# EasyEDA Pro project GEOF_MainBoard.eprj

# Schematic Schematic1
Board Name: Board1; Create Date: 2025-01-05; Page Name: P1; Project Name: GEOF_MainBoard; Schematic Name: Schematic1; Update Date: 2025-01-18; Company: EasyEDA.com; Page Size: A4; Version: 1.1
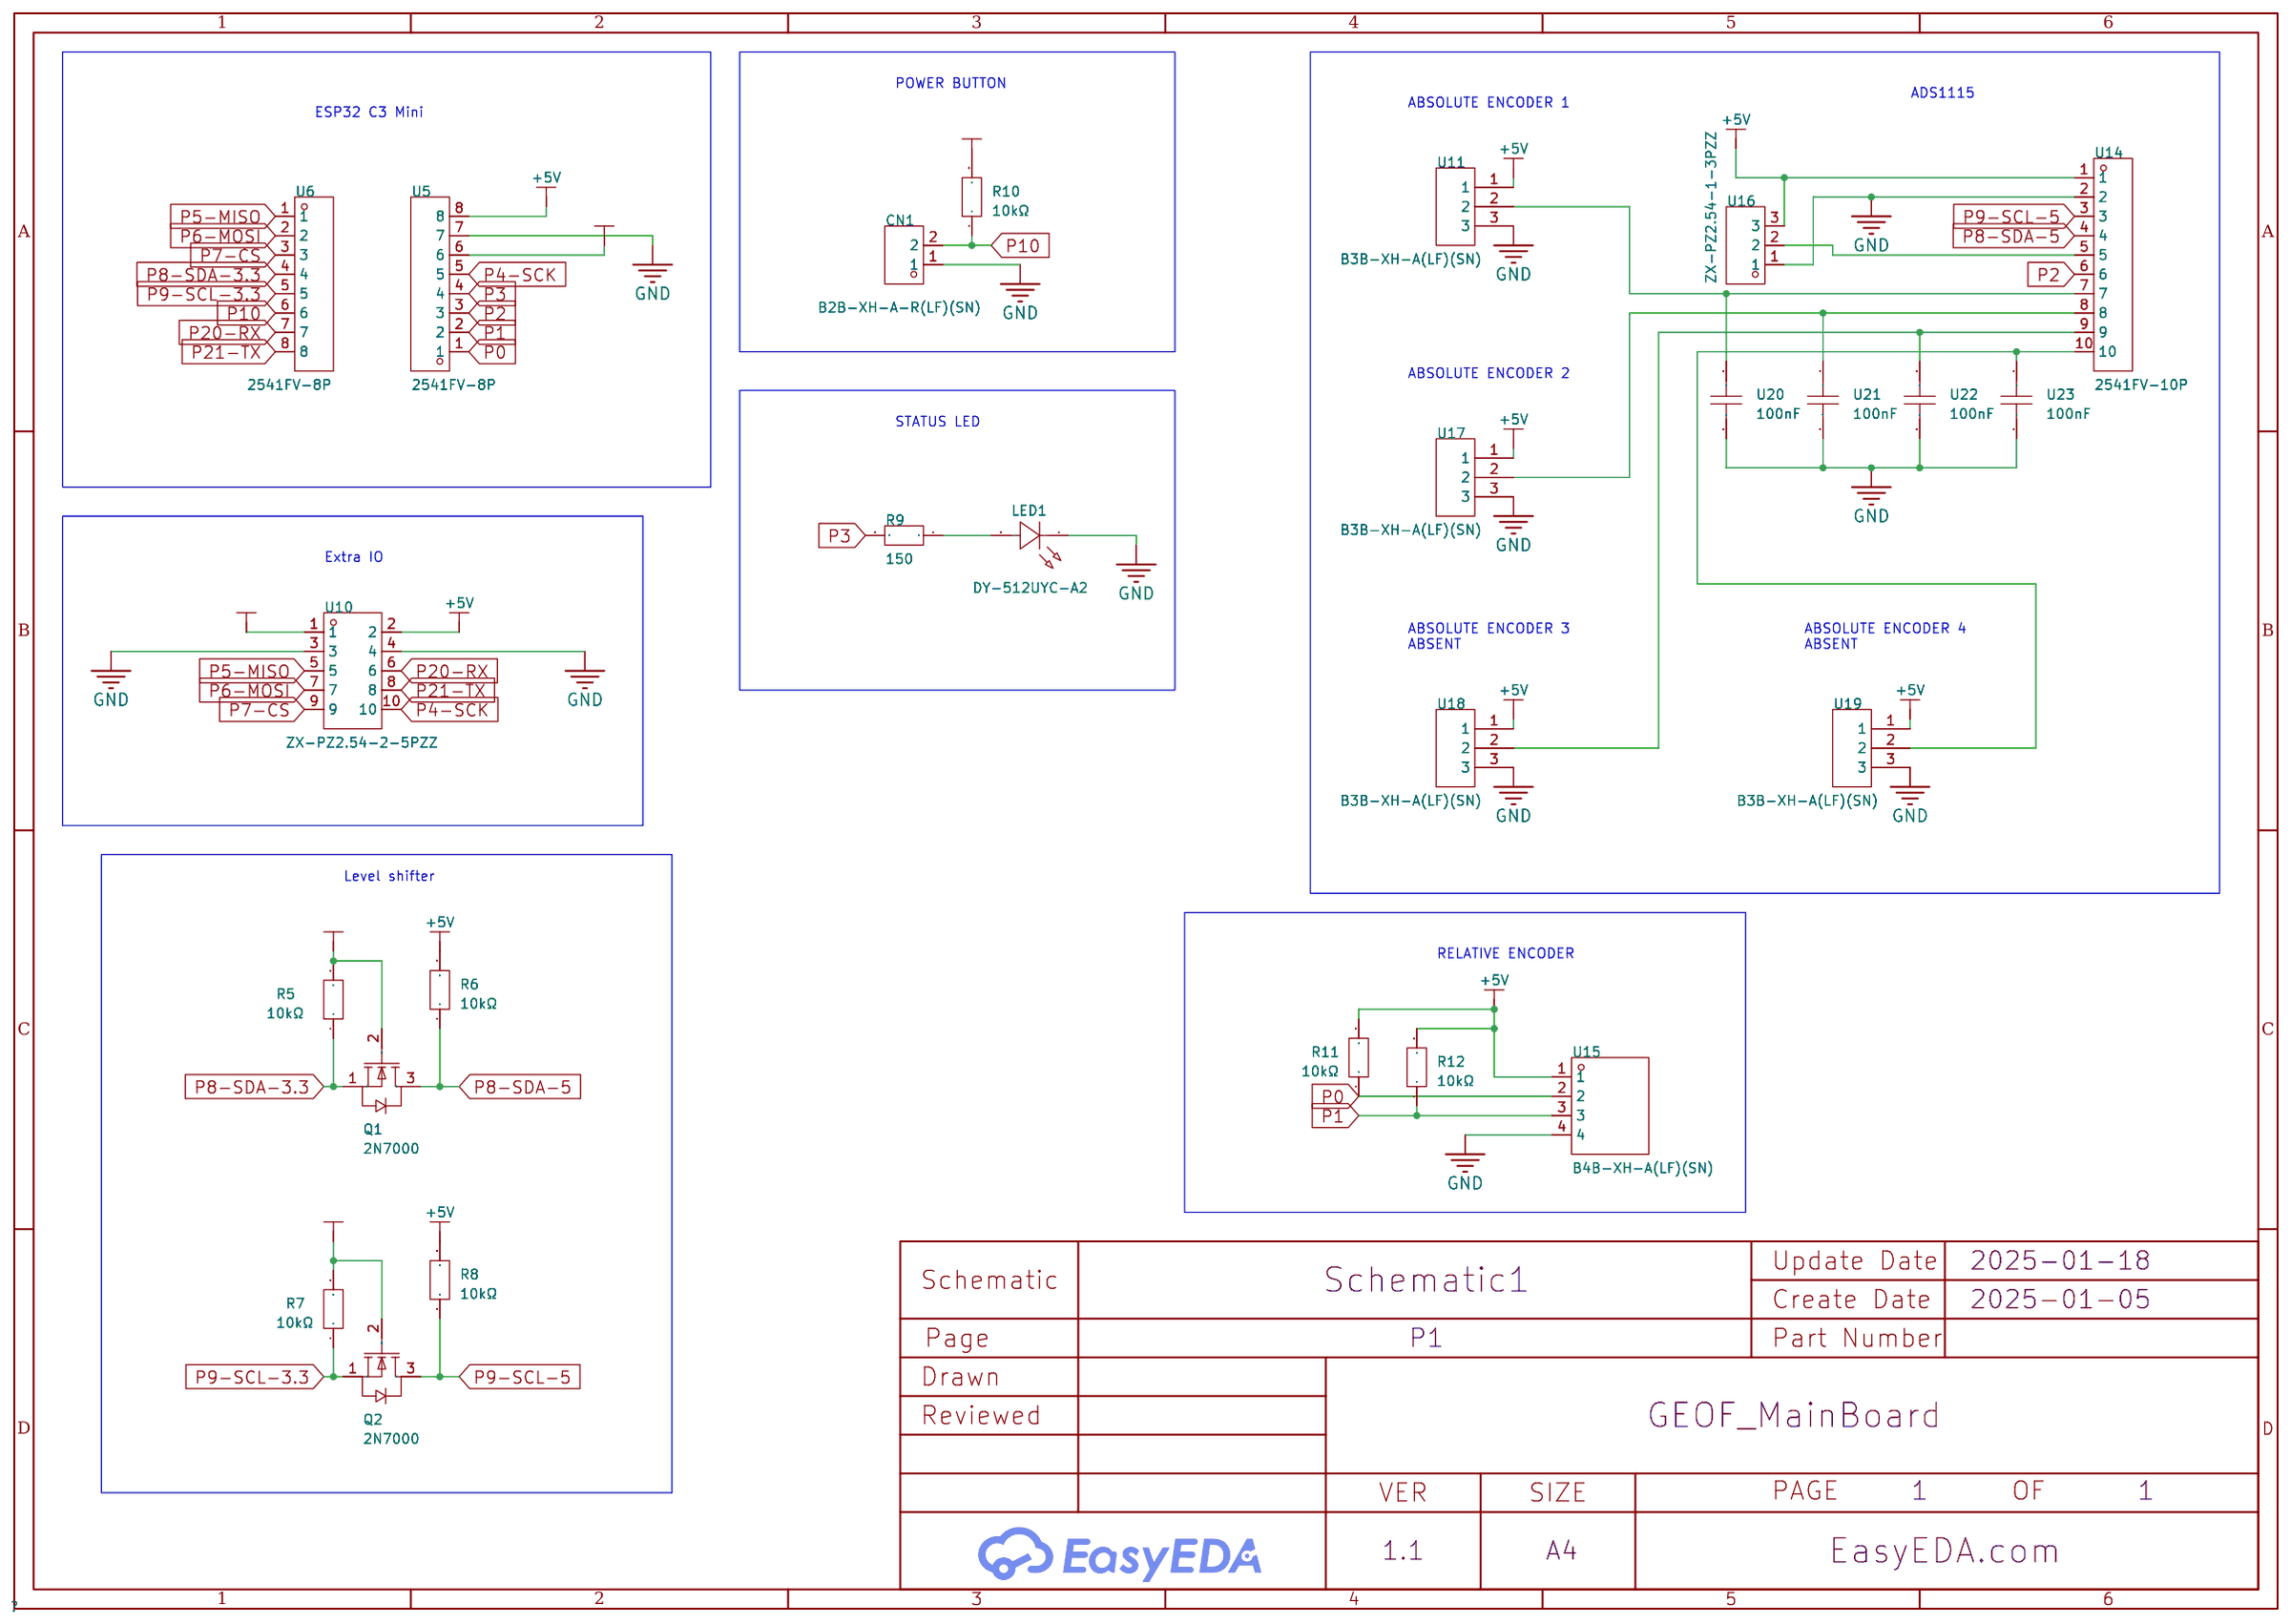
[diagram p0: schematic sheet]

## Parts
CN1  B2B-XH-A-R(LF)(SN)  [CONN-TH_B2B-XH-A]
LED1  DY-512UYC-A2  [LED-TH_L3.2-W2.0-P2.54-RD]
Q1  2N7000  [TO-92-3_L4.9-W3.7-P1.27-L]
Q2  2N7000  [TO-92-3_L4.9-W3.7-P1.27-L]
R5  10kΩ  [RES-TH_BD2.7-L6.2-P10.20-D0.4]
R6  10kΩ  [RES-TH_BD2.7-L6.2-P10.20-D0.4]
R7  10kΩ  [RES-TH_BD2.7-L6.2-P10.20-D0.4]
R8  10kΩ  [RES-TH_BD2.7-L6.2-P10.20-D0.4]
R9  150  [RES-TH_BD2.7-L6.2-P10.20-D0.4]
R10  10kΩ  [RES-TH_BD2.7-L6.2-P10.20-D0.4]
R11  10kΩ  [RES-TH_BD2.7-L6.2-P10.20-D0.4]
R12  10kΩ  [RES-TH_BD2.7-L6.2-P10.20-D0.4]
U5  2541FV-8P  [HDR-TH_8P-P2.54-V-F]
U6  2541FV-8P  [HDR-TH_8P-P2.54-V-F]
U10  ZX-PZ2.54-2-5PZZ  [HDR-TH_10P-P2.54-V-M-R2-C5-S2.54]
U11  B3B-XH-A(LF)(SN)  [CONN-TH_3P-P2.50_A2501WV2-3P]
U14  2541FV-10P  [HDR-TH_10P-P2.54-V-F]
U15  B4B-XH-A(LF)(SN)  [CONN-TH_B4B-XH-A-LF-SN]
U16  ZX-PZ2.54-1-3PZZ  [HDR-TH_3P-P2.54-V-M-1]
U17  B3B-XH-A(LF)(SN)  [CONN-TH_3P-P2.50_A2501WV2-3P]
U18  B3B-XH-A(LF)(SN)  [CONN-TH_3P-P2.50_A2501WV2-3P]
U19  B3B-XH-A(LF)(SN)  [CONN-TH_3P-P2.50_A2501WV2-3P]
U20  100nF  [CAP-TH_L4.8-W2.4-P5.08-D0.6]
U21  100nF  [CAP-TH_L4.8-W2.4-P5.08-D0.6]
U22  100nF  [CAP-TH_L4.8-W2.4-P5.08-D0.6]
U23  100nF  [CAP-TH_L4.8-W2.4-P5.08-D0.6]

## Library data of the parts
CN1 = B2B-XH-A-R(LF)(SN): Pins Structure:1x2P Pitch:2.5mm Mounting Style:Direct Insert Reference Series:XH Number of Pins:2P Number of Rows:1 Number of PINs Per Row:2 Row Spacing:- Current Rating (Max):3A Contact Material:Brass Contact Plating:Tin Operating Temperature Range:-25℃~; LCSC Part Name: 1x2P 间距:2.5mm 直插 系列:XH; Supplier Part: C495685; Manufacturer: JST; Supplier Footprint: 插件,P=2.5mm; JLCPCB Part Class: Extended Part; Datasheet: https://atta.szlcsc.com/upload/public/pdf/source/20200407/C495685_79B155586C4C18317C5B8095BAFA39F5.pdf; Supplier: LCSC; Pins Structure: 1x2P; Pitch: 2.5mm; Mounting Style: Direct Insert; Reference Series: XH; Number of Pins: 2P; Number of Rows: 1; Number of PINs Per Row: 2; Current Rating (Max): 3A; Contact Material: Brass; Contact Plating: Tin; Operating Temperature Range: -25℃~+85℃; Rated Voltage (Max): 250V; Plastic Material: PA66; Flame Retardant Rating: UL94V-0; Supplementary Features: K-leg punch; Colour: Red; Z-Height of the Board: 7mm; X-Length of Bottom Edge on Board (Spacing Line): 7.4mm; Y-Width of Bottom Edge on Board: 5.75mm
LED1 = DY-512UYC-A2: LCSC Part Name: 黄灯; Supplier Part: C841519; Manufacturer: TONYU(东裕); Supplier Footprint: 插件,D=3.2mm; JLCPCB Part Class: Extended Part; Datasheet: https://atta.szlcsc.com/upload/public/pdf/source/20200922/C841519_B7E0EF698131DB490D3B1EBAF39E2160.pdf; Supplier: LCSC; Lamp Holder Type: 3.2mm Square Lamp Head; Emitted Color: Yellow; Forward Voltage (VF): 1.8V~2.4V; Power Dissipation: 60mW; Forward Current: 20mA; Dominant Wavelength: 588nm~595nm; Peak Wavelength: 593nm; Lens Color: Colorless transparent lens; Luminous Intensity: 63mcd~125mcd; Viewing Angle: 100°; Operating Temperature: -25℃~+80℃
Q1 Q2 = 2N7000: LCSC Part Name: 1个N沟道 耐压:60V 电流:200mA; Supplier Part: C232838; Manufacturer: onsemi(安森美); Supplier Footprint: TO-92-3; JLCPCB Part Class: Extended Part; Datasheet: https://atta.szlcsc.com/upload/public/pdf/source/20221020/6B07E43F0B4B9B39AB447A9A1885F5BD.pdf; Supplier: LCSC; Type: 1 N-Channel; Drain Source On Resistance (RDS(on)@Vgs,Id): 5Ω@10V,500mA; Gate Threshold Voltage (Vgs(th)@Id): 3V@1mA
R5-R12 = MF1/4W-10K±1%-ST52: LCSC Part Name: 金属膜电阻 10kΩ ±1% 250mW; Supplier Part: C2903232; Manufacturer: VO(翔胜); Supplier Footprint: 插件,D2.7xL6.2mm; JLCPCB Part Class: Extended Part; Datasheet: https://atta.szlcsc.com/upload/public/pdf/source/20200609/C601728_5AA4C0C8E12E11069DA2C3356F29D1F2.pdf; Supplier: LCSC; Type: Metal Film Resistors; Tolerance: ±1%; Overload Voltage (Max): 250V; Power(Watts): 250mW; Temperature Coefficient: ±100ppm/℃; Operating Temperature Range: -55℃~+155℃
U5 U6 = 2541FV-8P: Holes Structure:1x8P Pitch:2.54mm Circular Hole / Square Hole:Square Hole Mounting Type:Direct Insert Number of Rows:Single Row Number of Holes:8P Current Rating (Max):3A Voltage Rating (Max):250V Holes Direction:Top Operating Temperature Range:-40℃~+105℃; LCSC Part Name: 间距:2.54mm 1x8P 直插; Supplier Part: C18723052; Manufacturer: HanElectricity(瀚源); Supplier Footprint: 插件,P=2.54mm; JLCPCB Part Class: Extended Part; Datasheet: https://atta.szlcsc.com/upload/public/pdf/source/20231018/B668E998F75351C6E5E9C8B59ACADD5C.pdf; Supplier: LCSC; Holes Structure: 1x8P; Pitch: 2.54mm; Circular Hole / Square Hole: Square Hole; Mounting Type: Direct Insert; Number of Rows: Single Row; Number of Holes: 8P; Current Rating (Max): 3A; Voltage Rating (Max): 250V; Holes Direction: Top; Operating Temperature Range: -40℃~+105℃
U10 = ZX-PZ2.54-2-5PZZ: Pin Structure:2x5P Pitch:2.54mm Row Spacing:2.54mm Circluar Pins/Square Pins:Square Pins Mounting Type:Straight Number of Rows:双排 Number of Pins:10P Current Rating (Max):3A Voltage Rating (Max):1kV Length of Mating Pin:6mm Insulation Height:2.5mm Length o; LCSC Part Name: 2x5P 间距:2.54mm 方针 直插; Supplier Part: C7501276; Manufacturer: Megastar(兆星); Supplier Footprint: 插件,P=2.54mm; JLCPCB Part Class: Extended Part; Datasheet: https://atta.szlcsc.com/upload/public/pdf/source/20231122/7DD2FA5A7FDBC10CDDB6051CB6BC6AD1.pdf; Supplier: LCSC; Pin Structure: 2x5P; Pitch: 2.54mm; Row Spacing: 2.54mm; Circluar Pins/Square Pins: Square Pins; Mounting Type: Straight; Number of Rows: 双排; Number of Pins: 10P; Current Rating (Max): 3A; Voltage Rating (Max): 1kV; Length of Mating Pin: 6mm; Insulation Height: 2.5mm; Length of End Connection Pin: 3mm; Contact Plating: Gold; Operating Temperature Range: -40℃~+105℃; Color: Black
U11 U17-U19 = B3B-XH-A(LF)(SN): Pins Structure:1x3P Pitch:2.5mm Mounting Style:Direct Insert Reference Series:XH Number of Pins:3P Number of Rows:1 Number of PINs Per Row:3 Row Spacing:- Current Rating (Max):3A Contact Material:Brass Contact Plating:Tin Operating Temperature Range:-25℃~; LCSC Part Name: 1x3P 间距:2.5mm 直插 系列:XH; Supplier Part: C144394; Manufacturer: JST; Supplier Footprint: 插件,P=2.5mm; JLCPCB Part Class: Extended Part; Datasheet: https://atta.szlcsc.com/upload/public/pdf/source/20180928/C265283_F9DFEEBDB2CF642B6BDFAB4B77BD2680.pdf; Supplier: LCSC; Pins Structure: 1x3P; Pitch: 2.5mm; Mounting Style: Direct Insert; Reference Series: XH; Number of Pins: 3P; Number of Rows: 1; Number of PINs Per Row: 3; Current Rating (Max): 3A; Contact Material: Brass; Contact Plating: Tin; Operating Temperature Range: -25℃~+85℃; Rated Voltage (Max): 250V; Plastic Material: PA66; Flame Retardant Rating: UL94V-0; Supplementary Features: K-leg punch; Colour: White; Z-Height of the Board: 7mm; X-Length of Bottom Edge on Board (Spacing Line): 9.9mm; Y-Width of Bottom Edge on Board: 5.75mm
U14 = 2541FV-10P: LCSC Part Name: 间距:2.54mm 1x10P 直插; Supplier Part: C18722933; Manufacturer: HanElectricity(瀚源); Supplier Footprint: 插件,P=2.54mm; JLCPCB Part Class: Extended Part; Datasheet: https://atta.szlcsc.com/upload/public/pdf/source/20231018/B668E998F75351C6E5E9C8B59ACADD5C.pdf; Supplier: LCSC; Holes Structure: 1x10P; Pitch: 2.54mm; Circular Hole / Square Hole: Square Hole; Mounting Type: Direct Insert; Number of Rows: Single Row; Number of Holes: 10P; Current Rating (Max): 3A; Voltage Rating (Max): 250V; Holes Direction: Top; Operating Temperature Range: -40℃~+105℃
U15 = B4B-XH-A(LF)(SN): LCSC Part Name: 1x4P 间距:2.5mm 直插 系列:XH; Supplier Part: C144395; Manufacturer: JST; Supplier Footprint: 插件,P=2.5mm; JLCPCB Part Class: Extended Part; Datasheet: https://atta.szlcsc.com/upload/public/pdf/source/20180928/C265283_F9DFEEBDB2CF642B6BDFAB4B77BD2680.pdf; Supplier: LCSC; Pins Structure: 1x4P; Pitch: 2.5mm; Mounting Style: Direct Insert; Reference Series: XH; Number of Pins: 4P; Number of Rows: 1; Number of PINs Per Row: 4; Current Rating (Max): 3A; Contact Material: Brass; Contact Plating: Tin; Operating Temperature Range: -25℃~+85℃; Rated Voltage (Max): 250V; Plastic Material: PA66; Flame Retardant Rating: UL94V-0; Supplementary Features: K-leg punch; Colour: White; Z-Height of the Board: 7mm; X-Length of Bottom Edge on Board (Spacing Line): 12.4mm; Y-Width of Bottom Edge on Board: 5.75mm
U16 = ZX-PZ2.54-1-3PZZ: LCSC Part Name: 1x3P 间距:2.54mm 方针 直插; Supplier Part: C7501261; Manufacturer: Megastar(兆星); Supplier Footprint: 插件,P=2.54mm; JLCPCB Part Class: Extended Part; Datasheet: https://atta.szlcsc.com/upload/public/pdf/source/20231122/128CE55ADA98919261C8FB693BAA0356.pdf; Supplier: LCSC; Pin Structure: 1x3P; Pitch: 2.54mm; Circluar Pins/Square Pins: Square Pins; Mounting Type: Straight; Number of Rows: Plugin; Number of Pins: 3P; Current Rating (Max): 3A; Voltage Rating (Max): 1kV; Length of Mating Pin: 6mm; Insulation Height: 2.5mm; Length of End Connection Pin: 3mm; Contact Plating: Gold; Operating Temperature Range: -40℃~+105℃; Color: Black
U20-U23 = 178MU0013: LCSC Part Name: 100nF ±10% 50V; Supplier Part: C5632437; Manufacturer: KNSCHA(科尼盛); Supplier Footprint: 插件,P=5.08mm; JLCPCB Part Class: Extended Part; Datasheet: https://atta.szlcsc.com/upload/public/pdf/source/20230506/C9B890CA552EFD22DFE029978FA4CE55.pdf; Supplier: LCSC; Tolerance: ±10%

## Nets
+3.3V: Q1.2(G) Q2.2(G) R5.2 R7.2 R10.2 U5.6 U10.1
+5V: R6.2 R8.2 R11.2 R12.2 U5.8 U10.2 U11.1 U14.1 U15.1 U16.3 U17.1 U18.1 U19.1
GND: CN1.1 LED1.1(-) U5.7 U10.3 U10.4 U11.3 U14.2 U15.4 U16.1 U17.3 U18.3 U19.3 U20.2 U21.2 U22.2 U23.2
P0: R11.1 U5.1 U15.2
P1: R12.1 U5.2 U15.3
P2: U5.3 U14.6
P3: R9.2 U5.4
P4-SCK: U5.5 U10.10
P5-MISO: U6.1 U10.5
P6-MOSI: U6.2 U10.7
P7-CS: U6.3 U10.9
P8-SDA-3.3: Q1.1(S) R5.1 U6.4
P8-SDA-5: Q1.3(D) R6.1 U14.4
P9-SCL-3.3: Q2.1(S) R7.1 U6.5
P9-SCL-5: Q2.3(D) R8.1 U14.3
P10: CN1.2 R10.1 U6.6
P20-RX: U6.7 U10.6
P21-TX: U6.8 U10.8
$1N2092: U14.10 U19.2 U23.1
$1N2194: U11.2 U14.7 U20.1
$1N2439: U14.5 U16.2
$1N2897: U14.8 U17.2 U21.1
$1N2901: U14.9 U18.2 U22.1
$1N4568: LED1.2(+) R9.1

## Notes on the sheet
- POWER BUTTON
- ABSOLUTE ENCODER 1
- ADS1115
- ESP32 C3 Mini
- ABSOLUTE ENCODER 2
- STATUS LED
- Extra IO
- ABSOLUTE ENCODER 3
  ABSENT
- ABSOLUTE ENCODER 4
  ABSENT
- Level shifter
- RELATIVE ENCODER

# Board PCB1
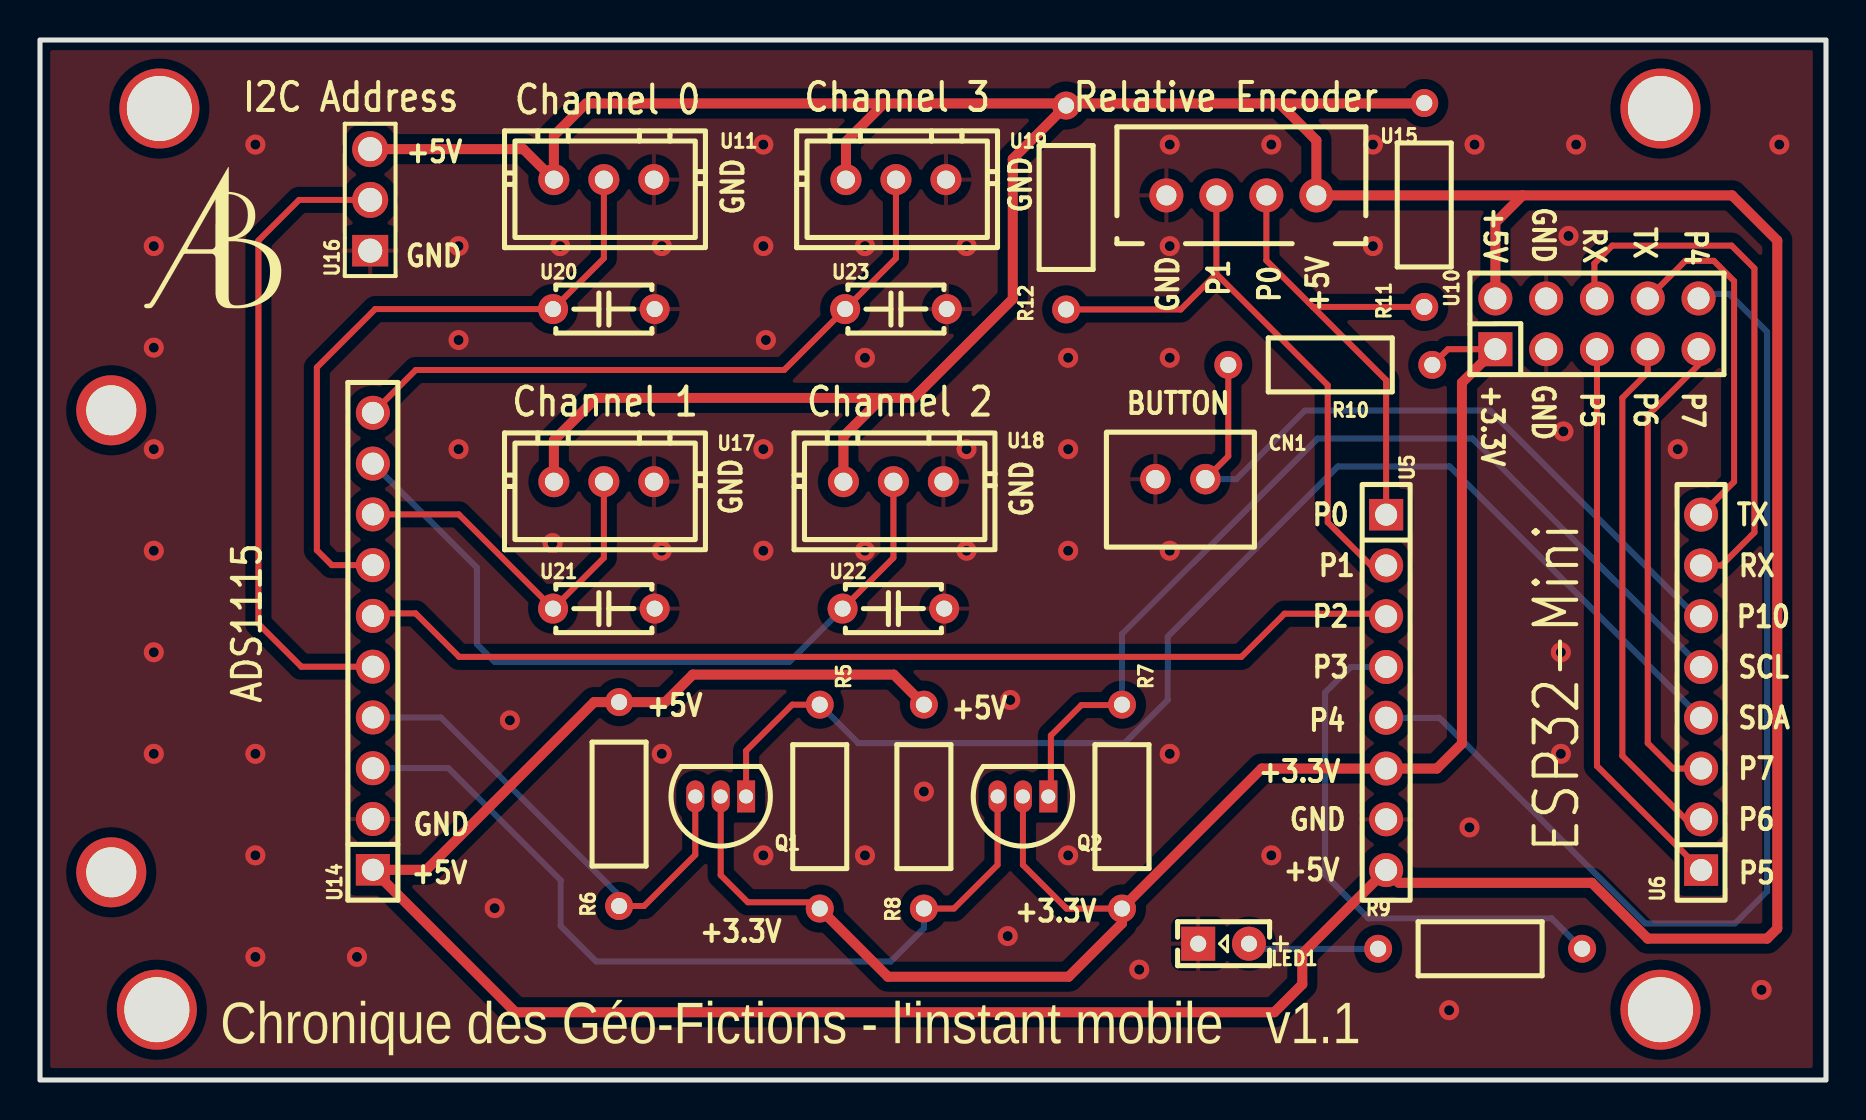
[diagram p1: board, top side]
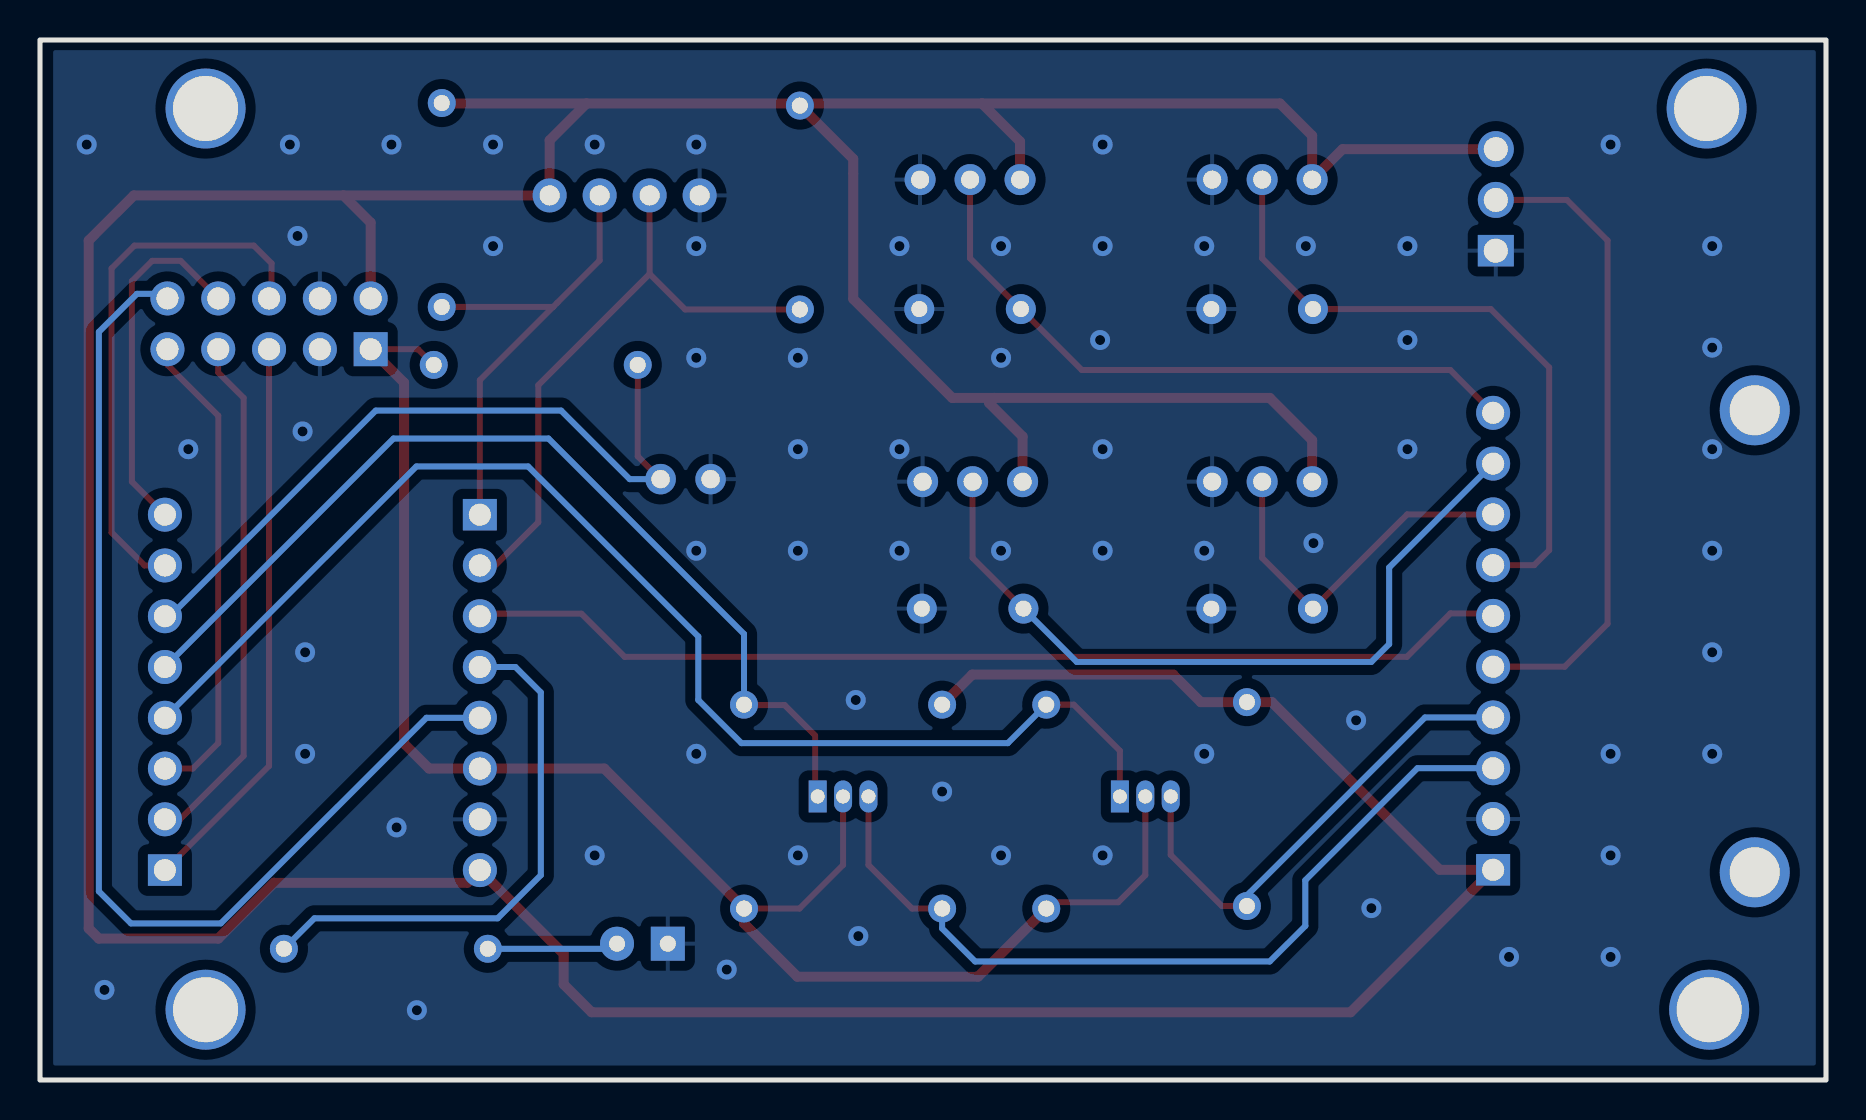
[diagram p2: board, bottom side, seen from below]

Outline 89.3 x 52.03 mm; copper layers: Top Layer, Bottom Layer. Coordinates in mm from the lower left corner of the outline.
Outline path: rectangle 0,52.03 89.3,0
Stack: Top Layer 0.035mm / Dielectric1 1.51mm FR4 er 4.5 / Bottom Layer 0.035mm

## Design rules (mm)
template: Custom Config
spacing copperThickness1oz: track to track 0.102, other pairs 0.152 to 0.3
spacing copperThickness2oz (default): track to track 0.203, other pairs 0.152 to 0.5
track width copperThickness1oz: min 0.127, default 0.254, max 2.54
track width copperThickness2oz (default): min 0.203, default 0.254, max 2.54
differential pair differentialPair (default): width min 0.127, default 0.254, max 2.54; gap min 0.152, default 0.152
via viaSize (default): diameter min 0.5, default 0.61, max 10; hole min 0.3, default 0.305, max 6.3

## Placement (name value [footprint] x y rotation side)
CN1  B2B-XH-A-R(LF)(SN)  [CONN-TH_B2B-XH-A]  57.02 30.06 0 top
LED1  DY-512UYC-A2  [LED-TH_L3.2-W2.0-P2.54-RD]  59.18 6.82 0 top
NOREF  -  [Pad_e79]  3.56 33.51 270 top
NOREF#2  -  [Pad_e6]  5.84 3.52 0 top
NOREF#3  -  [Pad_e82]  3.56 10.39 270 top
NOREF#4  -  [Pad_e5]  5.97 48.6 0 top
NOREF#5  -  [Pad_e8]  81.03 48.6 0 top
NOREF#6  -  [Pad_e7]  81.03 3.52 0 top
Q1  2N7000  [TO-92-3_L4.9-W3.7-P1.27-L]  34.04 14.19 180 top
Q2  2N7000  [TO-92-3_L4.9-W3.7-P1.27-L]  49.15 14.19 180 top
R5  10kΩ  [RES-TH_BD2.7-L6.2-P10.20-D0.4]  38.99 13.68 270 top
R6  10kΩ  [RES-TH_BD2.7-L6.2-P10.20-D0.4]  28.96 13.81 90 top
R7  10kΩ  [RES-TH_BD2.7-L6.2-P10.20-D0.4]  54.1 13.68 270 top
R8  10kΩ  [RES-TH_BD2.7-L6.2-P10.20-D0.4]  44.2 13.68 90 top
R9  150  [RES-TH_BD2.7-L6.2-P10.20-D0.4]  72.01 6.57 0 top
R10  10kΩ  [RES-TH_BD2.7-L6.2-P10.20-D0.4]  64.52 35.78 0 top
R11  10kΩ  [RES-TH_BD2.7-L6.2-P10.20-D0.4]  69.22 43.78 90 top
R12  10kΩ  [RES-TH_BD2.7-L6.2-P10.20-D0.4]  51.31 43.65 90 top
U5  2541FV-8P  [HDR-TH_8P-P2.54-V-F]  67.31 19.39 270 top
U6  2541FV-8P  [HDR-TH_8P-P2.54-V-F]  83.06 19.39 90 top
U10  ZX-PZ2.54-2-5PZZ  [HDR-TH_10P-P2.54-V-M-R2-C5-S2.54]  77.85 37.83 0 top
U11  B3B-XH-A(LF)(SN)  [CONN-TH_3P-P2.50_A2501WV2-3P]  28.19 45.05 0 top
U14  2541FV-10P  [HDR-TH_10P-P2.54-V-F]  16.64 21.95 90 top
U15  B4B-XH-A(LF)(SN)  [CONN-TH_B4B-XH-A-LF-SN]  60.07 44.26 0 top
U16  ZX-PZ2.54-1-3PZZ  [HDR-TH_3P-P2.54-V-M-1]  16.51 44.03 90 top
U17  B3B-XH-A(LF)(SN)  [CONN-TH_3P-P2.50_A2501WV2-3P]  28.19 29.93 0 top
U18  B3B-XH-A(LF)(SN)  [CONN-TH_3P-P2.50_A2501WV2-3P]  42.67 29.93 0 top
U19  B3B-XH-A(LF)(SN)  [CONN-TH_3P-P2.50_A2501WV2-3P]  42.8 45.05 0 top
U20  100nF  [CAP-TH_L4.8-W2.4-P5.08-D0.6]  28.19 38.57 0 top
U21  100nF  [CAP-TH_L4.8-W2.4-P5.08-D0.6]  28.19 23.58 0 top
U22  100nF  [CAP-TH_L4.8-W2.4-P5.08-D0.6]  42.67 23.58 0 top
U23  100nF  [CAP-TH_L4.8-W2.4-P5.08-D0.6]  42.8 38.57 0 top

## Footprints (pads in the part's own frame, mm; a bottom-side part is the same pattern mirrored in y, then rotated)
CAP-TH_L4.8-W2.4-P5.08-D0.6
  round 1.5 hole 0.8: 1(-2.54,0) 2(2.54,0)
CONN-TH_3P-P2.50_A2501WV2-3P
  round 1.55 hole 0.9: 1(-2.5,0) 2(0,0) 3(2.5,0)
CONN-TH_B2B-XH-A
  round 1.524 hole 0.914: 1(-1.25,0) 2(1.25,0)
CONN-TH_B4B-XH-A-LF-SN
  round 1.7 hole 1: 1(3.75,0) 2(1.25,0) 3(-1.25,0) 4(-3.75,0)
HDR-TH_3P-P2.54-V-M-1
  rect 1.575x1.8 hole 1.2: 1(-2.54,0)
  round 1.8 hole 1.2: 2(0,0) 3(2.54,0)
HDR-TH_8P-P2.54-V-F
  rect 1.575x1.7 hole 1.1: 1(-8.89,0)
  round 1.7 hole 1.1: 2(-6.35,0) 3(-3.81,0) 4(-1.27,0) 5(1.27,0) 6(3.81,0) 7(6.35,0) 8(8.89,0)
HDR-TH_10P-P2.54-V-F
  rect 1.575x1.7 hole 1.1: 1(-11.43,0)
  round 1.7 hole 1.1: 2(-8.89,0) 3(-6.35,0) 4(-3.81,0) 5(-1.27,0) 6(1.27,0) 7(3.81,0) 8(6.35,0) 9(8.89,0) 10(11.43,0)
HDR-TH_10P-P2.54-V-M-R2-C5-S2.54
  rect 1.7x1.7 hole 1.1: 1(-5.08,-1.27)
  round 1.7 hole 1.1: 2(-5.08,1.27) 3(-2.54,-1.27) 4(-2.54,1.27) 5(0,-1.27) 6(0,1.27) 7(2.54,-1.27) 8(2.54,1.27) 9(5.08,-1.27) 10(5.08,1.27)
LED-TH_L3.2-W2.0-P2.54-RD
  rect 1.7x1.7 hole 0.8: 1(-1.27,0)
  round 1.7 hole 0.8: 2(1.27,0)
Pad_e5
  round 4 hole 3.25: 1(0,0)
Pad_e6
  round 4 hole 3.25: 1(0,0)
Pad_e7
  round 4 hole 3.25: 1(0,0)
Pad_e8
  round 4 hole 3.25: 1(0,0)
Pad_e79
  round 3.5 hole 2.5: 1(0,0)
Pad_e82
  round 3.5 hole 2.5: 1(0,0)
RES-TH_BD2.7-L6.2-P10.20-D0.4
  round 1.4 hole 0.8: 1(-5.1,0) 2(5.1,0)
TO-92-3_L4.9-W3.7-P1.27-L
  rect 0.9x1.6 hole 0.7: 1(-1.27,0)
  oval 0.9x1.6 hole 0.7: 2(0,0) 3(1.27,0)

## Nets
As in the schematic.

Pads without a net: NOREF 1; NOREF#2 1; NOREF#3 1; NOREF#4 1; NOREF#5 1; NOREF#6 1

## Via types
v1: diameter 1, hole 0.5, Top Layer to Bottom Layer, 62 vias

## Routing (per net, layer and track width the routed paths; a pad name or vN(x,y) marks a point on that pad's centre or on a via; arc(x,y) is an arc through that point)
+3.3V: length 81.6
  Top Layer w0.3: R10.2 70.4,36.56 U10.1 ; R5.2 38.67,8.89 35.39,8.89 34.04,10.25 Q1.2 ; R7.2 51.33,8.58 49.15,10.76 Q2.2
  Top Layer w0.5: R5.2 42.4,5.17 51.44,5.17 54.1,7.84 R7.2 54.1,8.6 61.09,15.58 U5.6 69.85,15.58 71.1,16.83 71.1,34.89 U10.1
+5V: length 284.9
  Top Layer w0.5: 74.13,44.26 U15.1 63.82,47.01 61.98,48.86 ; 74.13,44.26 72.77,42.89 U10.2 ; 74.13,44.26 84.61,44.26 86.87,42 86.87,7.58 86.36,7.07 80.39,7.07 77.6,9.87 67.94,9.87 U5.8 63.12,6.31 63.12,4.79 61.72,3.39 23.77,3.39 U14.1 19.32,10.52 27.71,18.91 31.26,18.91 32.64,20.28 42.69,20.28 R8.2 ; U17.1 25.69,32.01 27.81,34.13 41.59,34.13 ; U18.1 40.17,32.2 41.85,33.87 41.59,34.13 ; 41.59,34.13 43.69,34.13 48.64,39.08 48.64,46.08 R12.2 ; 61.98,48.86 69.19,48.86 R11.2 ; 61.98,48.86 42.2,48.86 ; U16.3 24.17,46.57 U11.1 25.69,47.25 27.31,48.86 42.2,48.86 ; 42.2,48.86 40.3,46.95 U19.1
GND:
  vias: v1(5.69,41.72) v1(5.69,36.64) v1(5.69,31.56) v1(5.69,26.48) v1(5.69,21.4) v1(5.69,16.32) v1(10.77,46.8) v1(10.77,16.32) v1(10.77,11.24) v1(10.77,6.16) v1(15.85,6.16) v1(20.93,41.72) v1(20.93,37.02) v1(20.93,31.56) v1(22.73,8.6) v1(23.49,18) v1(25.63,26.86) v1(26.01,41.72) v1(31.09,41.72) v1(31.09,26.48) v1(31.09,16.32) v1(36.17,46.8) v1(36.17,41.72) v1(36.17,31.56) v1(36.17,26.48) v1(36.17,11.24) v1(36.3,37.02) v1(41.25,41.72) v1(41.25,36.13) v1(41.25,26.48) v1(41.25,11.24) v1(44.2,14.43) v1(46.33,41.72) v1(46.33,31.56) v1(46.33,26.48) v1(48.39,7.2) v1(48.51,19.01) v1(51.41,36.13) v1(51.41,31.56) v1(51.41,26.48) v1(51.41,11.24) v1(54.97,5.52) v1(56.49,46.8) v1(56.49,41.72) v1(56.49,36.13) v1(56.49,26.48) v1(56.49,16.32) v1(61.57,46.8) v1(61.57,11.24) v1(66.65,46.8) v1(66.65,41.72) v1(70.46,3.49) v1(71.48,12.64) v1(71.73,46.8) v1(76.05,21.4) v1(76.05,16.32) v1(76.17,32.45) v1(76.43,42.23) v1(76.81,46.8) v1(81.89,31.56) v1(86.08,4.51) v1(86.97,46.8)
P0: length 24
  Top Layer w0.3: 63.65,38.68 67.31,35.01 U5.1 ; 63.65,38.68 61.32,41 U15.2 ; 63.65,38.68 R11.1
P1: length 30.7
  Top Layer w0.3: 58.82,40.33 57.04,38.55 R12.1 ; 58.82,40.33 64.39,34.76 64.39,27.9 66.55,25.74 U5.2 ; 58.82,40.33 U15.3
P2: length 52.6
  Top Layer w0.3: U14.6 16.77,23.35 18.78,23.35 20.95,21.17 60.07,21.17 62.23,23.33 67.18,23.33 U5.3
P3: length 27.1
  Bottom Layer w0.3: R9.2 75.59,8.09 66.42,8.09 64.26,10.25 64.26,19.39 65.53,20.66 U5.4
P4-SCK: length 56.3
  Bottom Layer w0.3: U10.10 83.16,39.33 84.45,39.33 86.36,37.43 86.36,9.44 84.76,7.84 80.26,7.84 69.98,18.12 U5.5
P5-MISO: length 28.2
  Top Layer w0.3: U10.5 77.85,15.71 U6.1
P6-MOSI: length 26.1
  Top Layer w0.3: 83.06,13.04 82.3,13.04 79.12,16.22 79.12,34.13 80.39,35.4 U10.7
P7-CS: length 24
  Top Layer w0.3: U10.9 82.93,35.78 80.39,33.24 80.39,16.85 81.66,15.58 U6.3
P8-SDA-3.3: length 64.6
  Top Layer w0.3: Q1.1 35.31,16.47 37.61,18.78 R5.1
  Bottom Layer w0.3: U6.4 70.48,30.7 64.9,30.7 56.39,22.19 56.39,19.01 54.23,16.85 40.91,16.85 R5.1
P8-SDA-5: length 24.3
  Top Layer w0.3: R6.1 30.21,8.71 32.77,11.27 Q1.3
  Bottom Layer w0.3: U14.4 20.05,18.14 28.96,9.23 R6.1
P9-SCL-3.3: length 48.6
  Top Layer w0.3: Q2.1 50.55,14.31 50.55,17.23 52.07,18.76 54.08,18.76 R7.1
  Bottom Layer w0.3: U6.5 71.63,32.09 63.88,32.09 54.1,22.31 R7.1
P9-SCL-5: length 42.6
  Top Layer w0.3: Q2.3 47.88,10.76 45.7,8.58 R8.1
  Bottom Layer w0.3: U14.3 20.43,15.6 26.03,10 26.03,7.71 27.81,5.93 42.54,5.93 44.2,7.58 R8.1
P10: length 36.7
  Top Layer w0.3: R10.1 59.42,31.2 CN1.2
  Bottom Layer w0.3: CN1.2 59.82,30.06 63.25,33.49 72.52,33.49 82.8,23.2 U6.6
P20-RX: length 27.2
  Top Layer w0.3: U6.7 84.07,25.74 85.72,27.39 85.72,40.6 84.58,41.75 78.61,41.75 77.72,40.86 77.72,39.23 U10.6
P21-TX: length 17.9
  Top Layer w0.3: U10.8 82.27,40.98 83.69,40.98 84.71,39.97 84.71,29.93 U6.8
$1N2092: length 33.3
  Top Layer w0.3: U19.2 42.8,41.11 U23.1 37.21,35.52 18.79,35.52 U14.10
$1N2194: length 32.8
  Top Layer w0.3: U14.7 14.59,25.76 13.84,26.51 13.84,35.65 16.76,38.57 U20.1 28.19,41.11 U11.2
$1N2439: length 32.2
  Top Layer w0.3: U14.5 13.07,20.68 10.92,22.82 10.92,42 12.95,44.03 U16.2
$1N2897: length 18.4
  Top Layer w0.3: U17.2 28.19,26.12 U21.1 20.94,28.3 U14.8
$1N2901: length 38.3
  Top Layer w0.3: U22.1 42.67,26.12 U18.2
  Bottom Layer w0.3: U14.9 21.84,25.64 21.84,21.81 22.73,20.92 37.47,20.92 U22.1
$1N4568: length 6.6
  Bottom Layer w0.3: R9.1 60.71,6.57 LED1.2

## Copper pours and planes (outline as drawn; the poured copper is in the pictures)
GND on Top Layer: 0.51,51.52 88.65,51.52 88.65,0.6 0.51,0.6
GND on Bottom Layer: 0.51,51.52 88.65,51.52 88.65,0.72 0.51,0.72

## Text on the board
Top Silkscreen Layer: +5V | GND | P4 | P0 | P2 | P3 | P1 | +3.3V | P10 | TX | SCL | SDA | P7 | P6 | RX | P5 | BUTTON | Channel 1 | Channel 0 | Channel 3 | Channel 2 | Relative Encoder | I2C Address | ADS1115 | ESP32-Mini | Chronique des Géo-Fictions - l'instant mobile   v1.1
